# Altium project power_load.PrjPcb
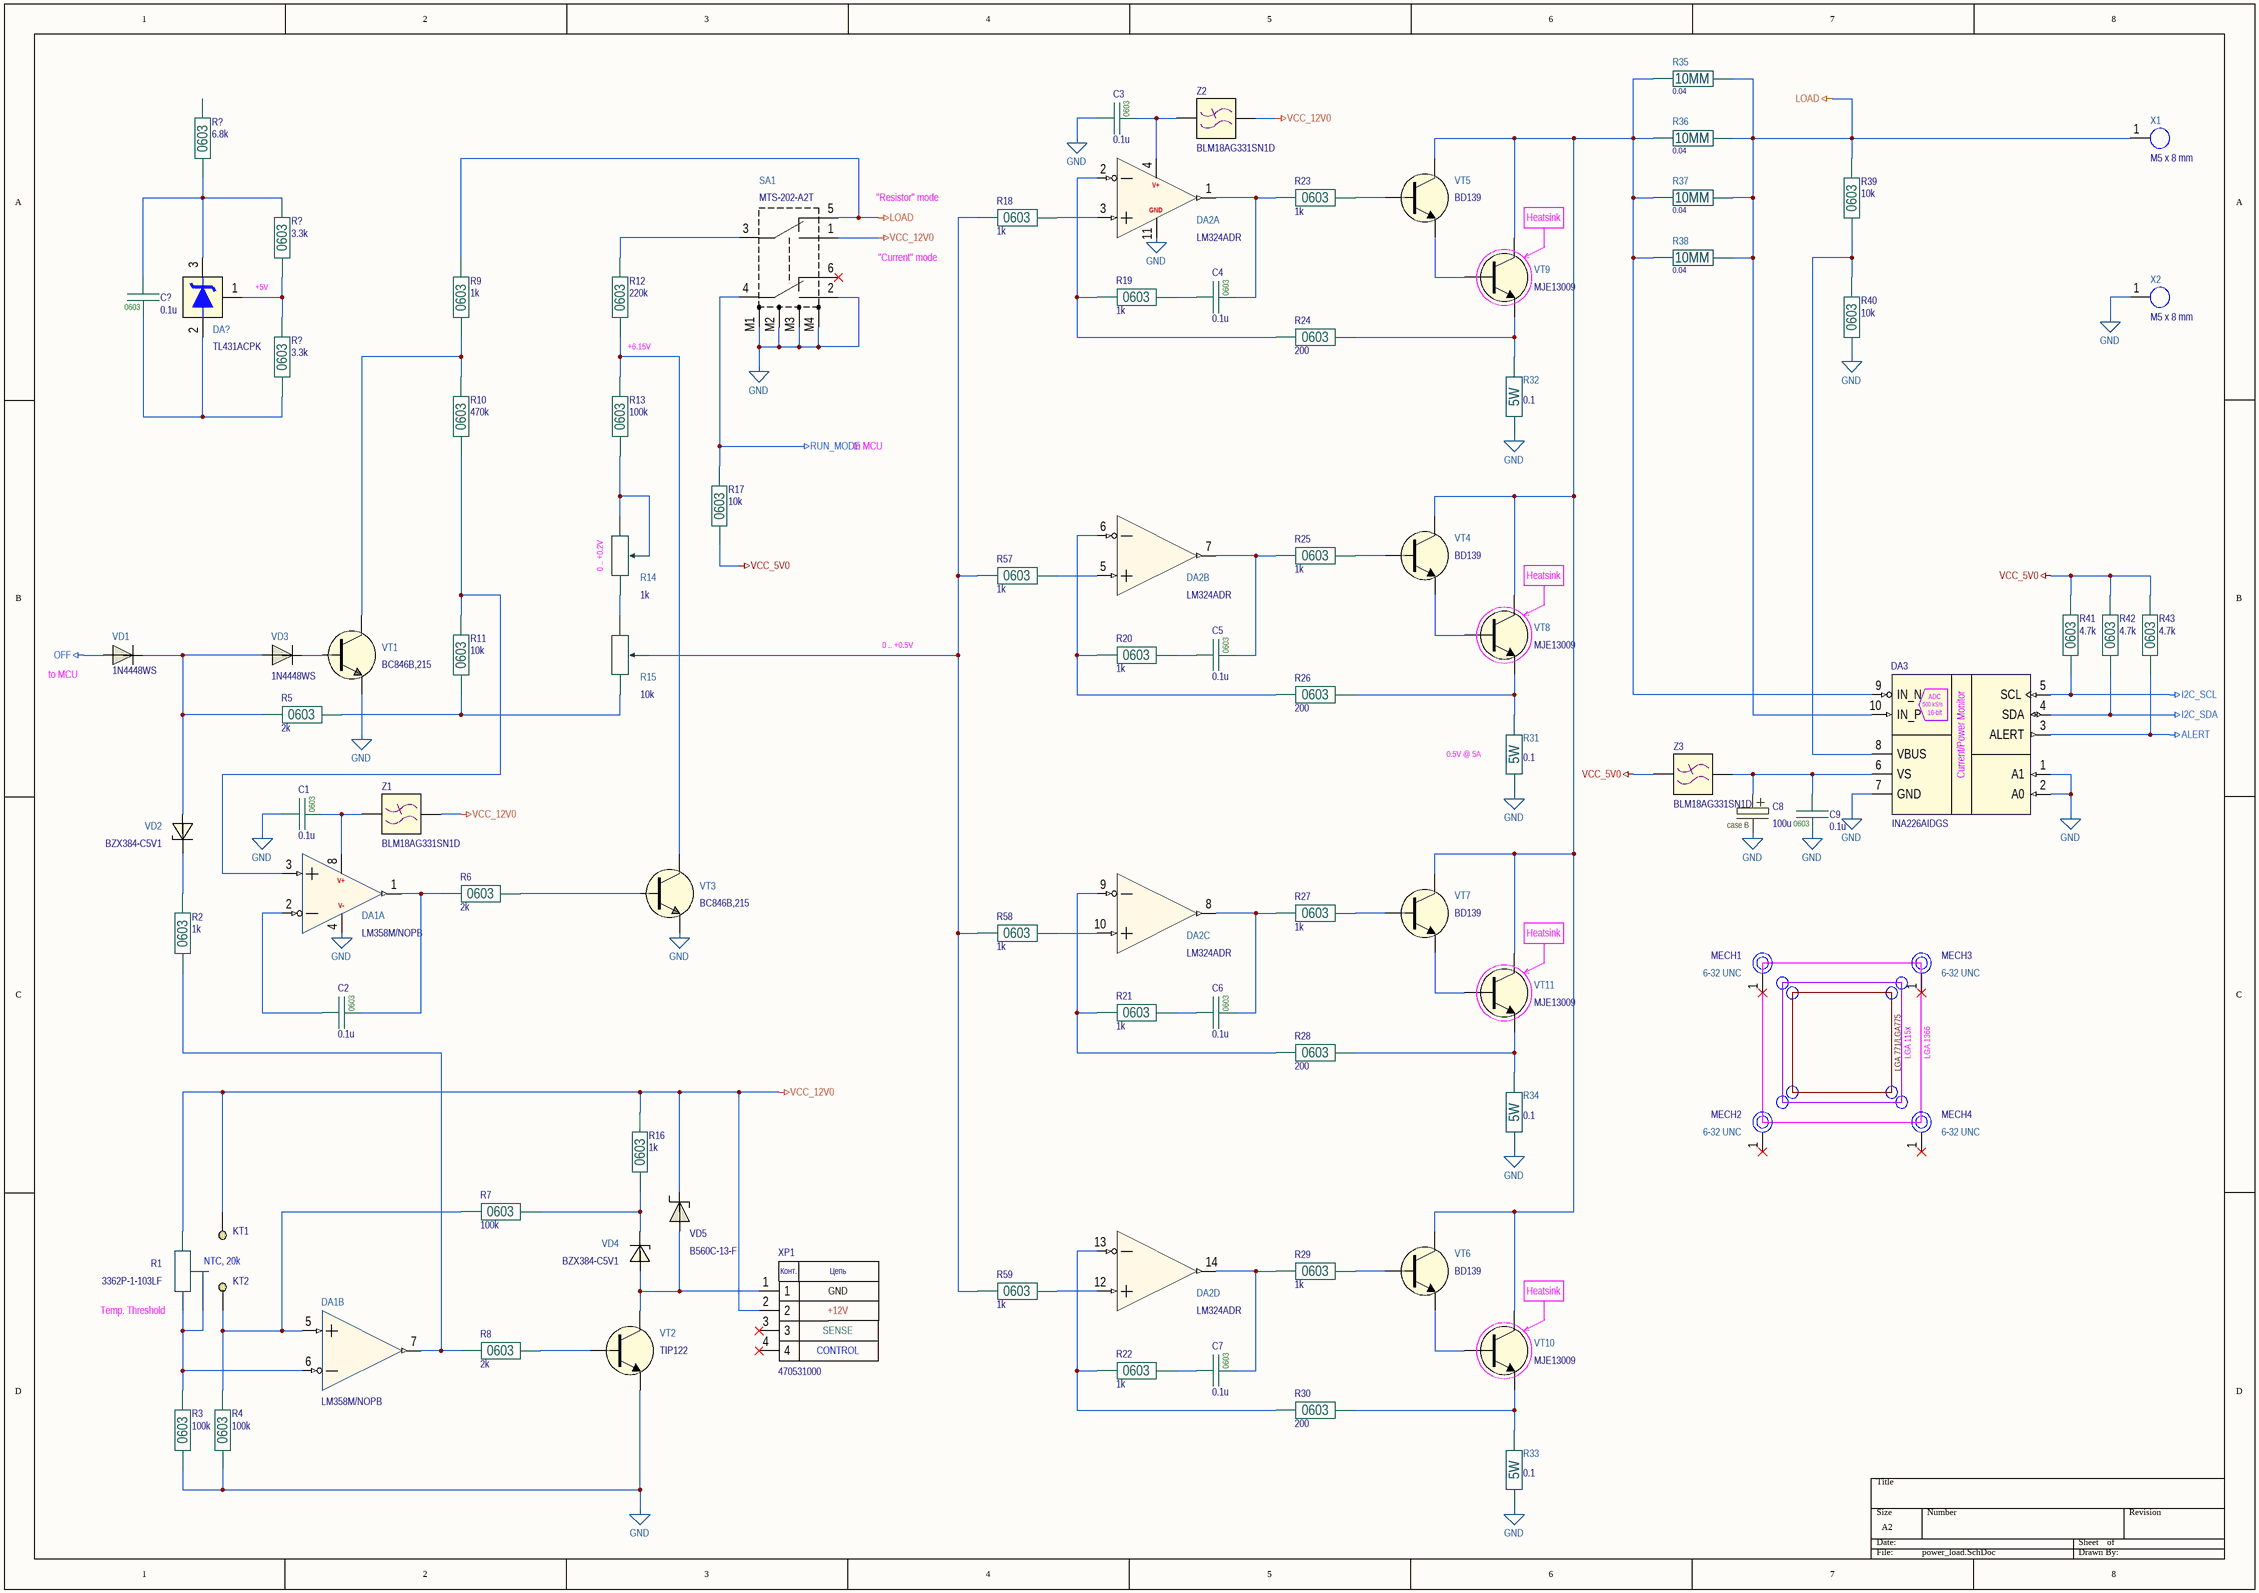
[diagram p0: power_load.SchDoc]
2 sheets, 150 parts. Net scope: global (net labels, ports and power ports of the same name join across sheets).
Board file: power_load.PcbDoc
Sheets:
  power_load.SchDoc
  mcu_and_input_power.SchDoc

## Sheet power_load.SchDoc
size A2; SheetNumber: 1; SheetTotal: 2

### Parts
(Parts that share a designator on the sheet are numbered #1, #2 ... from top to bottom, then left to right.)
C1  0.1u  Package: 0603  [CAP0603]
C2  0.1u  Package: 0603  [CAP0603]
C3  0.1u  Package: 0603  [CAP0603]
C4  0.1u  Package: 0603  [CAP0603]
C5  0.1u  Package: 0603  [CAP0603]
C6  0.1u  Package: 0603  [CAP0603]
C7  0.1u  Package: 0603  [CAP0603]
C8  100u  Package: case B  [CAP_CASE_B]
C9  0.1u  Package: 0603  [CAP0603]
C?  0.1u  Package: 0603  [CAP0603]
DA1  LM358M/NOPB  [SOIC-8]  (parts A,B of 2)
DA2  LM324ADR  [SOIC-14]  (parts A,B,C,D of 4)
DA3  INA226AIDGS  [VSSOP-10]
DA?  TL431ACPK  [SOT89-3]
KT1  TEST_PAD  [TEST_PAD_HOLE1.1x1.8]  (value not drawn)  (net tie, no BOM)
KT2  TEST_PAD  [TEST_PAD_HOLE1.1x1.8]  (value not drawn)  (net tie, no BOM)
MECH1  Thread: 6-32 UNC  [1612-2_SLOT]  (hidden comment: 1612-2)
MECH2  Thread: 6-32 UNC  [1612-2_SLOT]  (hidden comment: 1612-2)
MECH3  Thread: 6-32 UNC  [1612-2_SLOT]  (hidden comment: 1612-2)
MECH4  Thread: 6-32 UNC  [1612-2_SLOT]  (hidden comment: 1612-2)
R1  3362P-1-103LF  [3362P]
R2  1k  Package: 0603  [RES0603B]
R3  100k  Package: 0603  [RES0603B]
R4  100k  Package: 0603  [RES0603B]
R5  2k  Package: 0603  [RES0603B]
R6  2k  Package: 0603  [RES0603B]
R7  100k  Package: 0603  [RES0603B]
R8  2k  Package: 0603  [RES0603B]
R9  1k  Package: 0603  [RES0603B]
R10  470k  Package: 0603  [RES0603B]
R11  10k  Package: 0603  [RES0603B]
R12  220k  Package: 0603  [RES0603B]
R13  100k  Package: 0603  [RES0603B]
R14  value 1k  [PTV09A-4225F]  (hidden comment: PTV09A-4225F-B102)
R15  value 10k  [PTV09A-4225F]  (hidden comment: PTV09A-4225F-B103)
R16  1k  Package: 0603  [RES0603B]
R17  10k  Package: 0603  [RES0603C]
R18  1k  Package: 0603  [RES0603B]
R19  1k  Package: 0603  [RES0603B]
R20  1k  Package: 0603  [RES0603B]
R21  1k  Package: 0603  [RES0603B]
R22  1k  Package: 0603  [RES0603B]
R23  1k  Package: 0603  [RES0603B]
R24  200  Package: 0603  [RES0603B]
R25  1k  Package: 0603  [RES0603B]
R26  200  Package: 0603  [RES0603B]
R27  1k  Package: 0603  [RES0603B]
R28  200  Package: 0603  [RES0603B]
R29  1k  Package: 0603  [RES0603B]
R30  200  Package: 0603  [RES0603B]
R31  0.1  Package: 5W  [BPR58_HORIZONTAL]
R32  0.1  Package: 5W  [BPR58_HORIZONTAL]
R33  0.1  Package: 5W  [BPR58_HORIZONTAL]
R34  0.1  Package: 5W  [BPR58_HORIZONTAL]
R35  0.04  Package: 10MM  [CURRENT_SENSE_10x11mm]
R36  0.04  Package: 10MM  [CURRENT_SENSE_10x11mm]
R37  0.04  Package: 10MM  [CURRENT_SENSE_10x11mm]
R38  0.04  Package: 10MM  [CURRENT_SENSE_10x11mm]
R39  10k  Package: 0603  [RES0603C]
R40  10k  Package: 0603  [RES0603C]
R41  4.7k  Package: 0603  [RES0603B]
R42  4.7k  Package: 0603  [RES0603B]
R43  4.7k  Package: 0603  [RES0603B]
R57  1k  Package: 0603  [RES0603B]
R58  1k  Package: 0603  [RES0603B]
R59  1k  Package: 0603  [RES0603B]
R?#1  6.8k  Package: 0603  [RES0603B]
R?#2  3.3k  Package: 0603  [RES0603B]
R?#3  3.3k  Package: 0603  [RES0603B]
SA1  MTS-202-A2T  [MTS-202-A2T]
VD1  1N4448WS  [SOD-323F]
VD2  BZX384-C5V1  [SOD-323]
VD3  1N4448WS  [SOD-323F]
VD4  BZX384-C5V1  [SOD-323]
VD5  B560C-13-F  [DO-214AB]
VT1  BC846B,215  [SOT23-3]
VT2  TIP122  [TO-220AB-3]
VT3  BC846B,215  [SOT23-3]
VT4  BD139  [TO-126 (HORIZONTAL)]
VT5  BD139  [TO-126 (HORIZONTAL)]
VT6  BD139  [TO-126 (HORIZONTAL)]
VT7  BD139  [TO-126 (HORIZONTAL)]
VT8  MJE13009  [TO-3PN (HORIZONTAL, BOTTOM)]
VT9  MJE13009  [TO-3PN (HORIZONTAL, BOTTOM)]
VT10  MJE13009  [TO-3PN (HORIZONTAL, BOTTOM)]
VT11  MJE13009  [TO-3PN (HORIZONTAL, BOTTOM)]
X1  M5 x 8 mm  [STANDOFF_M5_8MM]
X2  M5 x 8 mm  [STANDOFF_M5_8MM]
XP1  470531000  [0470531000]
Z1  BLM18AG331SN1D  [BLM0603P]
Z2  BLM18AG331SN1D  [BLM0603P]
Z3  BLM18AG331SN1D  [BLM0603P]

### Nets
ALERT: DA3.3(ALERT) R43.1
GND: C1.2 C3.2 C8.2 C9.2 DA1.4(V-) DA2.11(GND) DA3.1(A1) DA3.2(A0) DA3.7(GND) R3.1 R4.1 R31.1 R32.1 R33.1 R34.1 R40.2 SA1.2 SA1.M1 SA1.M2 SA1.M3 SA1.M4 VT1.2(E) VT2.3(E) VT3.2(E) X2.1
I2C_SCL: DA3.5(SCL) R41.1
I2C_SDA: DA3.4(SDA) R42.1
LOAD: DA3.10(IN_P) R9.2 R35.2 R36.2 R37.2 R38.2 R39.1 SA1.5 X1.1
OFF: VD1.2(A)
RUN_MODE: R17.1 SA1.4
VCC_5V0: R17.2 R41.2 R42.2 R43.2 Z3.1
VCC_12V0: KT1.1 R1.1 R16.2 SA1.1 VD5.2(C) XP1.2 Z1.2 Z2.2
NetC1_1: C1.1 DA1.8(V+) Z1.1
NetC2_1: C2.1 DA1.1(1OUT) R6.1
NetC2_2: C2.2 DA1.2(1IN-)
NetC3_1: C3.1 DA2.4(VCC) Z2.1
NetC4_1: C4.1 DA2.1(1OUT) R23.1
NetC4_2: C4.2 R19.2
NetC5_1: C5.1 DA2.7(2OUT) R25.1
NetC5_2: C5.2 R20.2
NetC6_1: C6.1 DA2.8(3OUT) R27.1
NetC6_2: C6.2 R21.2
NetC7_1: C7.1 DA2.14(4OUT) R29.1
NetC7_2: C7.2 R22.2
NetC8_1: C8.1 C9.1 DA3.6(VS) Z3.2
NetC?_1: C?.1 DA?.3(CATHODE) R?#1.1 R?#2.2
NetC?_2: C?.2 DA?.2(ANODE) R?#3.1
NetDA1_3: DA1.3(1IN+) R10.1 R11.2
NetDA1_5: DA1.5(2IN+) KT2.1 R4.2 R7.2
NetDA1_6: DA1.6(2IN-) R1.2 R1.3 R3.2
NetDA1_7: DA1.7(2OUT) R2.1 R8.1
NetDA2_2: DA2.2(1IN-) R19.1 R24.1
NetDA2_3: DA2.3(1IN+) R18.2
NetDA2_5: DA2.5(2IN+) R57.2
NetDA2_6: DA2.6(2IN-) R20.1 R26.1
NetDA2_9: DA2.9(3IN-) R21.1 R28.1
NetDA2_10: DA2.10(3IN+) R58.2
NetDA2_12: DA2.12(4IN+) R59.2
NetDA2_13: DA2.13(4IN-) R22.1 R30.1
NetDA3_8: DA3.8(VBUS) R39.2 R40.1
NetDA3_9: DA3.9(IN_N) R35.1 R36.1 R37.1 R38.1 VT4.2(C) VT5.2(C) VT6.2(C) VT7.2(C) VT8.2(C) VT9.2(C) VT10.2(C) VT11.2(C)
NetDA?_1: DA?.1(REF) R?#2.1 R?#3.2
NetR2_2: R2.2 VD2.1
NetR5_1: R5.1 VD1.1(C) VD2.2 VD3.2(A)
NetR5_2: R5.2 R11.1 R15.1
NetR6_2: R6.2 VT3.1(B)
NetR7_1: R7.1 R16.1 VD4.1
NetR8_2: R8.2 VT2.1(B)
NetR9_1: R9.1 R10.2 VT1.3(C)
NetR12_1: R12.1 R13.2 VT3.3(C)
NetR12_2: R12.2 SA1.3
NetR13_1: R13.1 R14.2 R14.3
NetR14_1: R14.1 R15.3
NetR15_2: R15.2 R18.1 R57.1 R58.1 R59.1
NetR23_2: R23.2 VT5.1(B)
NetR24_2: R24.2 R32.2 VT9.3(E)
NetR25_2: R25.2 VT4.1(B)
NetR26_2: R26.2 R31.2 VT8.3(E)
NetR27_2: R27.2 VT7.1(B)
NetR28_2: R28.2 R34.2 VT11.3(E)
NetR29_2: R29.2 VT6.1(B)
NetR30_2: R30.2 R33.2 VT10.3(E)
NetVD3_1: VD3.1(C) VT1.1(B)
NetVD4_2: VD4.2 VD5.1(A) VT2.2(C) XP1.1
NetVT4_3: VT4.3(E) VT8.1(B)
NetVT5_3: VT5.3(E) VT9.1(B)
NetVT6_3: VT6.3(E) VT10.1(B)
NetVT7_3: VT7.3(E) VT11.1(B)

Not connected (* = marked no-connect by the designer): MECH1 1*; MECH2 1*; MECH3 1*; MECH4 1*; R?#1 2; SA1 6*; XP1 3* 4*

### Notes on the sheet
- "Resistor" mode
- (near VT9) Heatsink
- +5V
- "Current" mode
- (near R12) +6.15V
- to MCU
- (near R14) 0 .. +0.2V
- (near VT8) Heatsink
- 0 .. +0.5V
- (near R31) 0.5V @ 5A
- (near VT11) Heatsink
- LGA 771/LGA775
- LGA 115x
- LGA 1366
- (near R1) Temp. Threshold
- (near R1) NTC, 20k
- (near VT10) Heatsink
- (in symbol 470531000) Конт.; Цепь; GND; +12V; SENSE; CONTROL
- (in symbol INA226AIDGS) ADC; 500 kS/s; 16-bit; Current/Power Monitor
- (in symbol LM324ADR, part A) V+

### Library data of the parts
C1-C7 C9 C? = C0603: Capacitors 0603 package case; Part Number: CL10B104KB8NNNC; Manufacturer: Samsung Sdi Co. Ltd; Tolerance: ± 10 %; Dielectric: X7R; Voltage: 50V; Value: 0.1u; Value on schem: 0.1u
C8 = C_CASEB: Tantalum capacitors case B; Part Number: 293D107X0010B2TE3; Manufacturer: Vishay Intertechnology Inc.; Tolerance: ± 10 %; Voltage: 10V; ESR: 2.5Ohm @ 100 kHz; Value: 100u; Value on schem: 100u; Series: 293D
DA1 = LM358M/NOPB: Low-Power, Dual-Operational Amplifiers; Manufacturer: Texas Instruments; Part Number: LM358M/NOPB; Package: SOIC-8
DA2 = LM324ADR: Low Power Quad Operational Amplifiers; Manufacturer: Texas Instruments; Part Number: LM324ADR; Package: SOIC-14
DA3 = INA226AIDGS: High-Side or Low-Side Measurement, / Bi-Directional Current and Power Monitor with I / 2C Compatible Interface; Manufacturer: Texas Instruments; Part Number: INA226AIDGS; Package: VSSOP-10
DA? = TL431ACPK: Precision Programmable Reference; Manufacturer: Texas Instruments; Part Number: TL431ACPK; Package: SOT-89
KT1 KT2 = TEST_PAD: Test pad
MECH1-MECH4 = 1612-2: Swage Threaded Standoffs 6-32 Thread x 0.250, H = 0.187; Manufacturer: Keystone; Part Number: 1612-2
R1 = 3362P-1-103LF: TRIMMER 10K OHM 0.5W PC PIN TOP; Manufacturer: Bourns Inc.; Part Number: 3362P-1-103LF; Power Dissipation: 0.5W; Value: 10k
R2 R9 R16 R18-R23 R25 R27 R29 R57-R59 = R0603: Resistor 0603 package case; Part Number: RC0603FR-071KL; Manufacturer: Yageo; Tolerance: ± 1 %; Temperature coefficient: ± 100 ppm/°C; Voltage: 75V; Value: 1k; Value on schem: 1k
R3 R4 R7 R13 = R0603: Resistor 0603 package case; Part Number: RC0603FR-07100KL; Manufacturer: Yageo; Tolerance: ± 1 %; Temperature coefficient: ± 100 ppm/°C; Voltage: 75V; Value: 100k; Value on schem: 100k
R5 R6 R8 = R0603: Resistor 0603 package case; Part Number: RC0603FR-072KL; Manufacturer: Yageo; Tolerance: ± 1 %; Temperature coefficient: ± 100 ppm/°C; Voltage: 75V; Value: 2k; Value on schem: 2k
R10 = R0603: Resistor 0603 package case; Part Number: RC0603FR-07470KL; Manufacturer: Yageo; Tolerance: ± 1 %; Temperature coefficient: ± 100 ppm/°C; Voltage: 75V; Value: 470k; Value on schem: 470k
R11 = R0603: Resistor 0603 package case; Part Number: RC0603FR-0710KL; Manufacturer: Yageo; Tolerance: ± 1 %; Temperature coefficient: ± 100 ppm/°C; Voltage: 75V; Value: 10k; Value on schem: 10k
R12 = R0603: Resistor 0603 package case; Part Number: RC0603FR-07220KL; Manufacturer: Yageo; Tolerance: ± 1 %; Temperature coefficient: ± 100 ppm/°C; Voltage: 75V; Value: 220k; Value on schem: 220k
R14 = PTV09A-4225F-B102: 1 kOhm Potentiometer; Manufacturer: Bourns Inc.; Power Dissipation: 0.05W; Part Number: PTV09A-4225F-B102
R15 = PTV09A-4225F-B103: 10 kOhm Potentiometer; Manufacturer: Bourns Inc.; Power Dissipation: 0.05W; Part Number: PTV09A-4225F-B103
R17 R39 R40 = R0603: Resistor 0603 package case; Part Number: ERA3AEB103V; Manufacturer: Matsushita; Tolerance: ± 0.1 %; Temperature coefficient: ± 25 ppm/°C; Voltage: 75V; Value: 10k; Value on schem: 10k
R24 R26 R28 R30 = R0603: Resistor 0603 package case; Part Number: RC0603FR-07200RL; Manufacturer: Yageo; Tolerance: ± 1 %; Temperature coefficient: ± 100 ppm/°C; Voltage: 75V; Value: 200; Value on schem: 200
R31-R34 = BPR58: Rectangular type metal plate resistors; Part Number: BPR58CR10J; Manufacturer: KOA Speer; Tolerance: ± 5 %; Temperature Coefficient: ±350 /°C; Value: 0.1; Value on schem: 0.1
R35-R38 = SHUNT_10MM: Constantan shunt resistor, pitch = 10mm; Tolerance: ±  %; Temperature Coefficient: ±*/°C; Value: 0.04; Value on schem: 0.04; Part Number: *; Manufacturer: *; Voltage: *
R41-R43 = R0603: Resistor 0603 package case; Part Number: RC0603FR-074K7L; Manufacturer: Yageo; Tolerance: ± 1 %; Temperature coefficient: ± 100 ppm/°C; Voltage: 75V; Value: 4.7k; Value on schem: 4.7k
R?#1 = R0603: Resistor 0603 package case; Part Number: RC0603FR-076K8L; Manufacturer: Yageo; Tolerance: ± 1 %; Temperature coefficient: ± 100 ppm/°C; Voltage: 75V; Value: 6.8k; Value on schem: 6.8k
R?#2 R?#3 = R0603: Resistor 0603 package case; Part Number: RC0603FR-073K3L; Manufacturer: Yageo; Tolerance: ± 1 %; Temperature coefficient: ± 100 ppm/°C; Voltage: 75V; Value: 3.3k; Value on schem: 3.3k
SA1 = MTS-202-A2T: Switch; Manufacturer: RUICHI; Part Number: MTS-202-A2T
VD1 VD3 = 1N4448WS: Diode 75V, 150mA; Manufacturer: ON Semiconductor; Package: SOD-323F; Part Number: 1N4448WS
VD2 VD4 = BZX384-C5V1: Voltage regulator diodes 5.1V; Package: SOD-323; Part Number: BZX384-C5V1
VD5 = B560C-13-F: Diode Schottky 60V, 5A; Manufacturer: Diodes Incorporated; Package: SMC/DO-214AB; Part Number: B560C-13-F
VT1 VT3 = BC846B,215: General Purpose n-p-n Transistors; Manufacturer: Nexperia USA Inc.; Package: SOT23-3; Part Number: BC846B,215
VT2 = TIP122: Power Darlington Transistor; Manufacturer: STMicroelectronics; Package: TO-220; Part Number: TIP122
VT4-VT7 = BD139: General Purpose n-p-n Transistors; Manufacturer: STMicroelectronics; Package: TO-126; Part Number: BD139
VT8-VT11 = MJE13009: General Purpose n-p-n Transistors 400V, 12A, 100W; Manufacturer: Inchange Semiconductor; Package: TO-220A; Part Number: MJE13009
X1 X2 = STANDOFF_M5_8MM: Standoffs M5 Thread x 0.8, H = 8 mm; Part Number: M5 x 8 mm; Thread: M5
XP1 = 470531000: Designator: XP*; Part Number: 470531000
Z1-Z3 = BLM18AG331SN1D: Power line filter, imperdance 330 Ohm (current 05A); Part Number: BLM18AG331SN1D; Package: 0603

## Sheet mcu_and_input_power.SchDoc
size A2; SheetNumber: 2; SheetTotal: 2
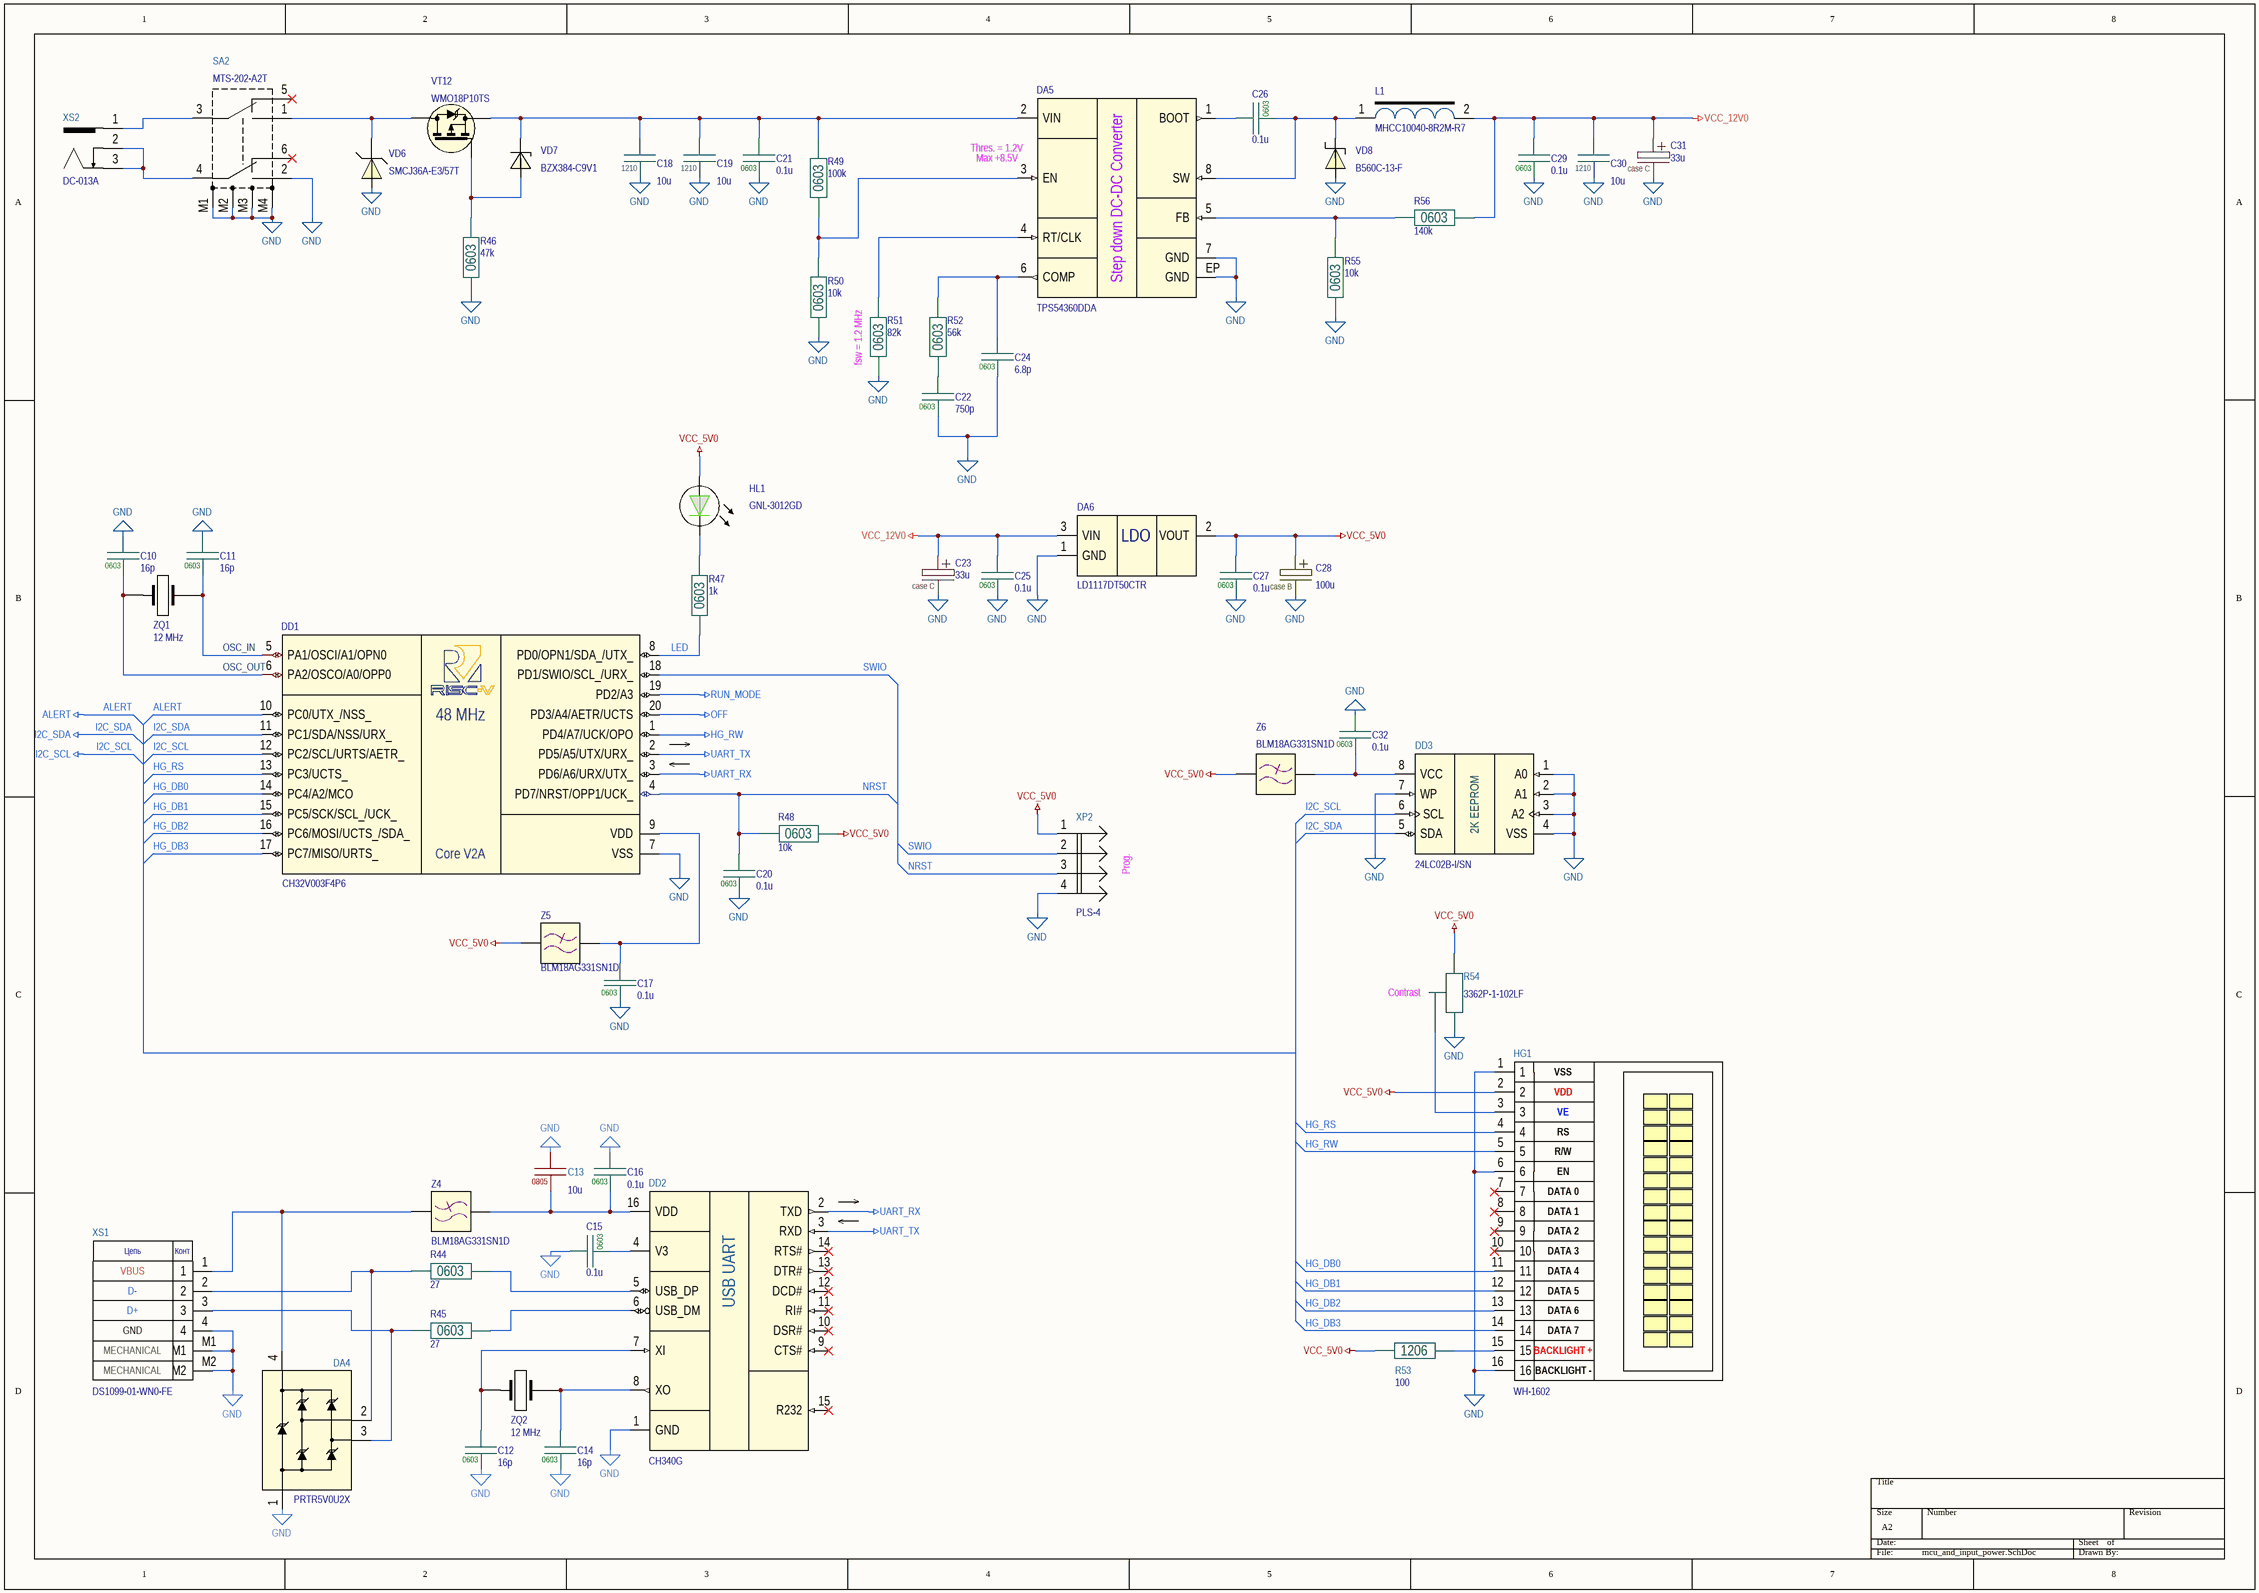
[diagram p1: mcu_and_input_power.SchDoc]

### Parts
C10  16p  Package: 0603  [CAP0603]
C11  16p  Package: 0603  [CAP0603]
C12  16p  Package: 0603  [CAP0603]
C13  10u  Package: 0805  [CAP0805-0.75]
C14  16p  Package: 0603  [CAP0603]
C15  0.1u  Package: 0603  [CAP0603]
C16  0.1u  Package: 0603  [CAP0603]
C17  0.1u  Package: 0603  [CAP0603]
C18  10u  Package: 1210  [CAP1210-2.2]
C19  10u  Package: 1210  [CAP1210-2.2]
C20  0.1u  Package: 0603  [CAP0603]
C21  0.1u  Package: 0603  [CAP0603]
C22  750p  Package: 0603  [CAP0603]
C23  33u  Package: case C  [CAP_CASE_C]
C24  6.8p  Package: 0603  [CAP0603]
C25  0.1u  Package: 0603  [CAP0603]
C26  0.1u  Package: 0603  [CAP0603]
C27  0.1u  Package: 0603  [CAP0603]
C28  100u  Package: case B  [CAP_CASE_B]
C29  0.1u  Package: 0603  [CAP0603]
C30  10u  Package: 1210  [CAP1210-2.2]
C31  33u  Package: case C  [CAP_CASE_C]
C32  0.1u  Package: 0603  [CAP0603]
DA4  PRTR5V0U2X  [SOT143]
DA5  TPS54360DDA  [SOIC-8EP]
DA6  LD1117DT50CTR  [TO-252-3]
DD1  CH32V003F4P6  [TSSOP-20]
DD2  CH340G  [SOIC-16]
DD3  24LC02B-I/SN  [SOIC-8]
HG1  WH-1602  [WH1602]
HL1  GNL-3012GD  [GNL-3012GD]
L1  MHCC10040-8R2M-R7  [MHCC10040]
R44  27  Package: 0603  [RES0603B]
R45  27  Package: 0603  [RES0603B]
R46  47k  Package: 0603  [RES0603B]
R47  1k  Package: 0603  [RES0603B]
R48  10k  Package: 0603  [RES0603B]
R49  100k  Package: 0603  [RES0603B]
R50  10k  Package: 0603  [RES0603B]
R51  82k  Package: 0603  [RES0603B]
R52  56k  Package: 0603  [RES0603B]
R53  100  Package: 1206  [RES1206C]
R54  3362P-1-102LF  [3362P]
R55  10k  Package: 0603  [RES0603B]
R56  140k  Package: 0603  [RES0603B]
SA2  MTS-202-A2T  [MTS-202-A2T]
VD6  SMCJ36A-E3/57T  [DO-214AB]
VD7  BZX384-C9V1  [SOD-323]
VD8  B560C-13-F  [DO-214AB]
VT12  WMO18P10TS  [TO-252-3]
XP2  PLS-4  [PLS-4]
XS1  DS1099-01-WN0-FE  [DS1099-01-WN0-FE]
XS2  DC-013A  [DC-013A]
Z4  BLM18AG331SN1D  [BLM0603P]
Z5  BLM18AG331SN1D  [BLM0603P]
Z6  BLM18AG331SN1D  [BLM0603P]
ZQ1  Frequency: 12 MHz  [HC-49/US_With_Hole]  (hidden comment: SJK-6C-12.000-16-30-50-B-50-H)
ZQ2  Frequency: 12 MHz  [HC-49/US_With_Hole]  (hidden comment: SJK-6C-12.000-16-30-50-B-50-H)

### Nets
ALERT: DD1.10(PC0/UTX_/NSS_)
GND: C10.2 C11.2 C12.1 C13.2 C14.1 C15.2 C16.2 C17.1 C18.1 C19.1 C20.1 C21.1 C22.1 C23.2 C24.1 C25.1 C27.1 C28.2 C29.1 C30.1 C31.2 C32.2 DA4.1(GND) DA5.7(GND) DA5.EP(GND) DA6.1(GND) DD1.7(VSS) DD2.1(GND) DD3.1(A0) DD3.2(A1) DD3.3(A2) DD3.4(VSS) DD3.7(WP) HG1.1 HG1.6 HG1.16 R46.1 R50.1 R51.2 R54.3 R55.1 SA2.2 SA2.M1 SA2.M2 SA2.M3 SA2.M4 VD6.1(C) VD8.1(A) XP2.4 XS1.4 XS1.M1 XS1.M2
HG_RW: DD1.1(PD4/A7/UCK/OPO) HG1.5
I2C_SCL: DD1.12(PC2/SCL/URTS/AETR_) DD3.6(SCL)
I2C_SDA: DD1.11(PC1/SDA/NSS/URX_) DD3.5(SDA)
OFF: DD1.20(PD3/A4/AETR/UCTS)
RUN_MODE: DD1.19(PD2/A3)
UART_RX: DD1.3(PD6/A6/URX/UTX_) DD2.2(TXD)
UART_TX: DD1.2(PD5/A5/UTX/URX_) DD2.3(RXD)
VCC_5V0: C27.2 C28.1 DA6.2(VOUT) HG1.2 HL1.2 R48.2 R53.1 R54.1 XP2.1 Z5.2 Z6.2
VCC_12V0: C23.1 C25.2 C29.2 C30.2 C31.1 DA6.3(VIN) L1.2 R56.2
HG_DB0: DD1.14(PC4/A2/MCO) HG1.11
HG_DB1: DD1.15(PC5/SCK/SCL_/UCK_) HG1.12
HG_DB2: DD1.16(PC6/MOSI/UCTS_/SDA_) HG1.13
HG_DB3: DD1.17(PC7/MISO/URTS_) HG1.14
HG_RS: DD1.13(PC3/UCTS_) HG1.4
LED: DD1.8(PD0/OPN1/SDA_/UTX_) R47.1
NRST: C20.2 DD1.4(PD7/NRST/OPP1/UCK_) R48.1 XP2.3
OSC_IN: C11.1 DD1.5(PA1/OSCI/A1/OPN0) ZQ1.2(XTAL1)
OSC_OUT: C10.1 DD1.6(PA2/OSCO/A0/OPP0) ZQ1.1(XTAL0)
SWIO: DD1.18(PD1/SWIO/SCL_/URX_) XP2.2
NetC12_2: C12.2 DD2.7(XI) ZQ2.1(XTAL0)
NetC13_1: C13.1 C16.1 DD2.16(VDD) Z4.2
NetC14_2: C14.2 DD2.8(XO) ZQ2.2(XTAL1)
NetC15_1: C15.1 DD2.4(V3)
NetC17_2: C17.2 DD1.9(VDD) Z5.1
NetC18_2: C18.2 C19.2 C21.2 DA5.2(VIN) R49.1 VD7.1 VT12.3(S)
NetC22_2: C22.2 R52.2
NetC24_2: C24.2 DA5.6(COMP) R52.1
NetC26_1: C26.1 DA5.8(SW) L1.1 VD8.2(C)
NetC26_2: C26.2 DA5.1(BOOT)
NetC32_1: C32.1 DD3.8(VCC) Z6.1
NetDA4_2: DA4.2(IO1) R44.1 XS1.2
NetDA4_3: DA4.3(IO2) R45.1 XS1.3
NetDA4_4: DA4.4(VCC) XS1.1 Z4.1
NetDA5_3: DA5.3(EN) R49.2 R50.2
NetDA5_4: DA5.4(RT/CLK) R51.1
NetDA5_5: DA5.5(FB) R55.2 R56.1
NetDD2_5: DD2.5(USB_DP) R44.2
NetDD2_6: DD2.6(USB_DM) R45.2
NetHG1_3: HG1.3 R54.2
NetHG1_15: HG1.15 R53.2
NetHL1_1: HL1.1 R47.2
NetR46_2: R46.2 VD7.2 VT12.1(G)
NetSA2_1: SA2.1 VD6.2(A) VT12.2(D)
NetSA2_3: SA2.3 XS2.1
NetSA2_4: SA2.4 XS2.2 XS2.3

Not connected (* = marked no-connect by the designer): DD2 9(CTS#)* 10(DSR#)* 11(RI#)* 12(DCD#)* 13(DTR#)* 14(RTS#)* 15(R232)*; HG1 7* 8* 9* 10*; SA2 5* 6*

### Notes on the sheet
- (near DA5) Thres. = 1.2V
- (near DA5) Max +8.5V
- (near R51) fsw = 1.2 MHz
- Prog.
- (near R54) Contrast
- (in symbol 24LC02B-I/SN) 2K EEPROM
- (in symbol CH32V003F4P6) 48 MHz; Core V2A
- (in symbol CH340G) USB UART
- (in symbol DS1099-01-WN0-FE) Цепь; Конт; VBUS; D-; D+; GND; MECHANICAL
- (in symbol LD1117DT50CTR) LDO
- (in symbol TPS54360DDA) Step down DC-DC Converter
- (in symbol WH-1602) VSS; VDD; VE; RS; R/W; EN; DATA 0; DATA 1; DATA 2; DATA 3; DATA 4; DATA 5; DATA 6; DATA 7; BACKLIGHT +; BACKLIGHT -

### Library data of the parts
C10-C12 C14 = C0603: Capacitors 0603 package case; Part Number: CL10C120JB8NNNC; Manufacturer: Samsung; Tolerance: ± 5 %; Dielectric: NP0; Voltage: 50V; Value: 16p; Value on schem: 16p
C13 = C0805: Capacitors 0805 package case; Part Number: CL21B106KOQNNNE; Manufacturer: Samsung Sdi Co. Ltd; Tolerance: ± 10 %; Dielectric: X7R; Voltage: 16V; Value: 10u; Value on schem: 10u
C15-C17 C20 C21 C25-C27 C29 C32 = C0603: as C1 on sheet power_load; Value: 0.1u; Value on schem: 0.1u
C18 C19 C30 = C1210: Capacitors 1210 package case; Part Number: GRM32ER71J106KA12L; Manufacturer: Murata Electronics Inc.; Tolerance: ± 10 %; Dielectric: X7R; Voltage: 100V; Value: 10u; Value on schem: 10u
C22 = C0603: Capacitors 0603 package case; Part Number: CL10C751JB8NNNC; Manufacturer: Samsung Sdi Co. Ltd; Tolerance: ± 5 %; Dielectric: NP0; Voltage: 50V; Value: 750p; Value on schem: 750p
C23 C31 = C_CASEC: Tantalum capacitors case C; Part Number: 293D336X9020C2TE3; Manufacturer: VISHAY; Tolerance: ± 10 %; Voltage: 20V; ESR Ohm@kHz: 1.0; Value: 33u; Value on schem: 33u
C24 = C0603: Capacitors 0603 package case; Part Number: CL10C6R8CB8NNNC; Manufacturer: Samsung Sdi Co. Ltd; Tolerance: ± 0.25 pF; Dielectric: NP0; Voltage: 50V; Value: 6.8p; Value on schem: 6.8p
C28 = C_CASEB: as C8 on sheet power_load; Value: 100u; Value on schem: 100u; Series: 293D
DA4 = PRTR5V0U2X: Ultra low capacitance double rail-to-rail ESD protection diode; Manufacturer: NXP USA Inc.; Part Number: PRTR5V0U2X; Package: SOT-143
DA5 = TPS54360DDA: 60-V Input, 3.5-A, Step-Down DC/DC Converter With Eco-Mode; Manufacturer: Texas Instruments; Part Number: TPS54360DDA; Package: SOIC-8
DA6 = LD1117DT50CTR: Low drop positive voltage regulator; Manufacturer: STMicroelectronics; Part Number: LD1117DT50CTR; Package: TO-252-3
DD1 = CH32V003F4P6: RISC-V MCU 48MHz with 16KB flash, 2KB RAM; Manufacturer: WinChipHead; Package: TSSOP-20; Part Number: CH32V003F4P6
DD2 = CH340G: USB to Serial Port Chip; Manufacturer: WinChipHead; Package: SO-16; Part Number: CH340G
DD3 = 24LC02B-I/SN: 2K I2C Serial EEPROM; Manufacturer: Microchip Technology; Package: SOIC-8; Part Number: 24LC02B-I/SN
HG1 = WH-1602: 1602 Display with 16 pin PBS connector; Part Number: WH-1602
HL1 = GNL-3012GD: Standard Brightness 3mm LED; Manufacturer: G-Nor Optoelectronics; Color: Green, 565 nm; Package: 3mm; Part Number: GNL-3012GD
L1 = MHCC10040-8R2M-R7: Shielded SMD Power Inductor; Manufacturer: Chilisin Elec; RDC: 30 mOhm; Irms Typ: 6 A; Isat Typ: 9 A; Inductance @ 100 kHz: 8.2 uH; Part Number: MHCC10040-8R2M-R7; Package: 10.1x11.6x4 mm
R44 R45 = R0603: Resistor 0603 package case; Part Number: RC0603FR-0727RL; Manufacturer: Yageo; Tolerance: ± 1 %; Value: 27; Value on schem: 27
R46 = R0603: Resistor 0603 package case; Part Number: RC0603FR-0747KL; Manufacturer: Yageo; Tolerance: ± 1 %; Temperature coefficient: ± 100 ppm/°C; Voltage: 75V; Value: 47k; Value on schem: 47k
R47 = R0603: as R2 on sheet power_load; Value: 1k; Value on schem: 1k
R48 R50 R55 = R0603: as R11 on sheet power_load; Value: 10k; Value on schem: 10k
R49 = R0603: Resistor 0603 package case; Part Number: RC0603FR-07100KL; Manufacturer: Yageo; Tolerance: ± 1 %; Value: 100k; Value on schem: 100k
R51 = R0603: Resistor 0603 package case; Part Number: RC0603FR-0782KL; Manufacturer: Yageo; Tolerance: ± 1 %; Value: 82k; Value on schem: 82k
R52 = R0603: Resistor 0603 package case; Part Number: RC0603FR-0756KL; Manufacturer: Yageo; Tolerance: ± 1 %; Value: 56k; Value on schem: 56k
R53 = R1206: Resistor 1206 package case; Manufacturer: Yageo; Part Number: RC1206FR-07100RL; Tolerance: ± 1 %; Voltage: 200 V; Temperature Coefficient: ± 100 ppm/°C; Value: 100; Value on schem: 100
R54 = 3362P-1-102LF: TRIMMER 1K OHM 0.5W PC PIN TOP; Manufacturer: Bourns Inc.; Part Number: 3362P-1-102LF; Power Dissipation: 0.5W; Value: 1k
R56 = R0603: Resistor 0603 package case; Part Number: RC0603FR-07140KL; Manufacturer: Yageo; Tolerance: ± 1 %; Value: 140k; Value on schem: 140k
SA2 = MTS-202-A2T: Switch; Manufacturer: RUICHI; Part Number: MTS-202-A2T
VD6 = SMCJ36A-E3/57T: 36V Transient Voltage Suppressors; Manufacturer: Vishay; Part Number: SMCJ36A-E3/57T; Package: DO-214AB-2 (SMС)
VD7 = BZX384-C9V1: Voltage regulator diodes 9.1V; Package: SOD-323; Part Number: BZX384-C9V1
VD8 = B560C-13-F: as VD5 on sheet power_load; Package: SMC/DO-214AB; Part Number: B560C-13-F
VT12 = WMO18P10TS: P-Channel MOSFET, -100V, -18A; Manufacturer: Wayon; Part Number: WMO18P10TS; Package: TO-252
XS1 = DS1099-01-WN0-FE: USB Type B Vertical Female; Manufacturer: Connfly; Part Nubmer: DS1099-01-WN0-FE
XS2 = DC-013A: Straight DC Power Receptacle Connector 2mm x 6.4mm; Part Number: DC-013A
Z4-Z6 = BLM18AG331SN1D: as Z1 on sheet power_load; Part Number: BLM18AG331SN1D; Package: 0603
ZQ1 ZQ2 = HC-49: Crystal resonator; Manufacturer: SJK; Frequency Tolerance: ±30ppm; Load Capacitance: 16 pF; Package: HC-49US; Part Number: SJK-6C-12.000-16-30-50-B-50-H
XP2 = PLS-4: Value: PLS-4

## Nets that join several sheets
ALERT: power_load (DA3.3 R43.1), mcu_and_input_power (DD1.10)
GND: power_load (25 pins), mcu_and_input_power (52 pins)
I2C_SCL: power_load (DA3.5 R41.1), mcu_and_input_power (DD1.12 DD3.6)
I2C_SDA: power_load (DA3.4 R42.1), mcu_and_input_power (DD1.11 DD3.5)
OFF: power_load (VD1.2), mcu_and_input_power (DD1.20)
RUN_MODE: power_load (R17.1 SA1.4), mcu_and_input_power (DD1.19)
VCC_5V0: power_load (5 pins), mcu_and_input_power (11 pins)
VCC_12V0: power_load (8 pins), mcu_and_input_power (8 pins)